# EAGLE design bracket (EAGLE 6.4)
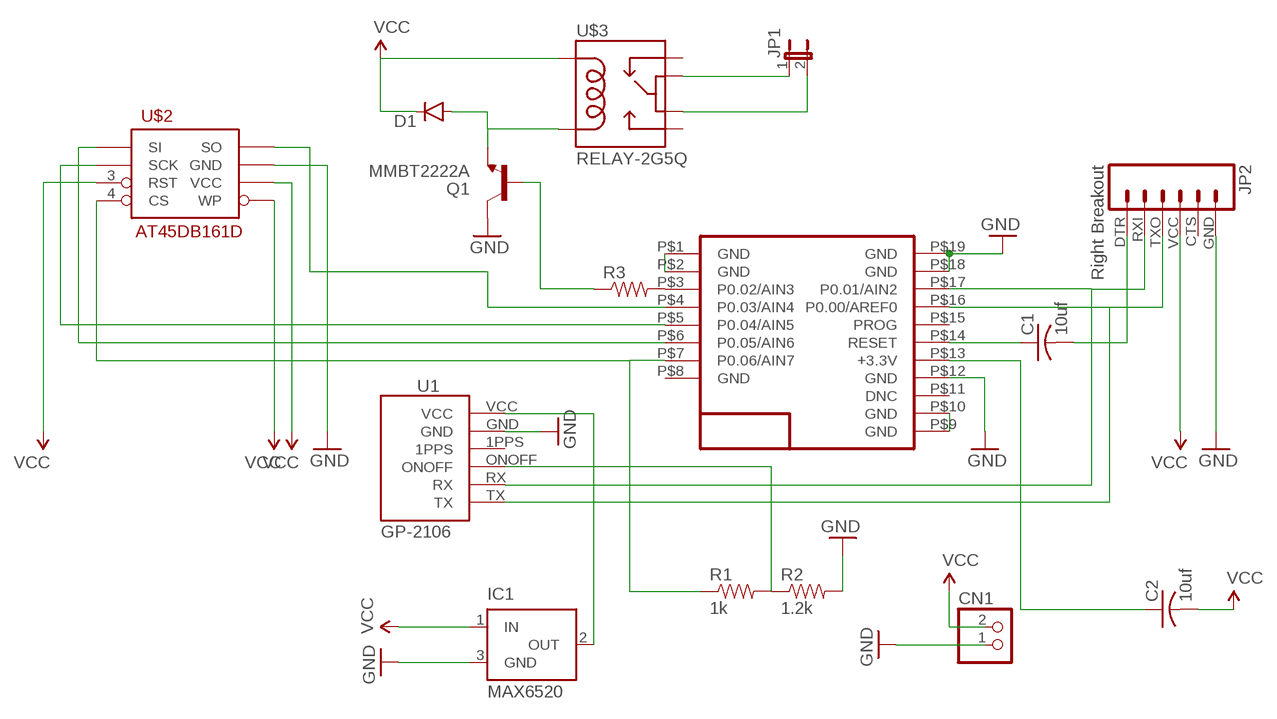
[diagram p0: schematic, sheet 1]

## Parts
C1  10uf  C-USC0603  [C0603]
C2  10uf  C-USC0603  [C0603]
CN1  JST_2PIN-SMT  [JST-PH-2-SMT]
D1  DIODESOD523  [SOD523]
IC1  MAX6520  [SOT23]
JP1  JP1E  [JP1]
JP2  Right Breakout  M06SIP  [1X06]
Q1  MMBT2222A  TRANSISTOR_NPNMMBT2222A  [SOT23-3]
R1  1k  RESISTOR0603-RES  [0603-RES]
R2  1.2k  RESISTOR0603-RES  [0603-RES]
R3  RESISTOR0603-RES  [0603-RES]
U1  GP-2106  [GP-2106]
U$1  RFD22301  [RFD21733]
U$2  AT45DB161D  [SO08-EIAJ]
U$3  RELAY-2G5Q  [RELAY-G5V]

## Nets
GND: CN1.1 IC1.3(GND) JP2.GND Q1.3(C) R2.2 U1.GND U$1.P$12(GND) U$1.P$18(GND) U$1.P$19(GND) U$2.7(GND)
N$1: JP2.RXI U1.RX U$1.P$17(P0.01/AIN2)
N$4: U$1.P$9(GND) U$1.P$10(GND)
N$5: U$1.P$1(GND) U$1.P$2(GND)
N$6: C1.1 U$1.P$14(RESET)
N$7: C1.2 JP2.DTR
N$8: JP2.TXO U1.TX U$1.P$16(P0.00/AREF0)
N$9: U$1.P$6(P0.05/AIN6) U$2.1(SI)
N$10: U$1.P$4(P0.03/AIN4) U$2.8(SO)
N$11: R3.2 U$1.P$3(P0.02/AIN3)
N$12: Q1.1(B) R3.1
N$13: D1.A Q1.2(E) U$3.9
N$14: U$1.P$5(P0.04/AIN5) U$2.2(SCK)
N$15: JP1.1 U$3.5
N$16: JP1.2 U$3.6
N$17: IC1.2(OUT) U1.VCC
N$18: R1.1 U$1.P$7(P0.06/AIN7) U$2.4(CS)
N$19: C2.1 U$1.P$13(+3.3V)
N$20: R1.2 R2.1 U1.ONOFF
VCC: C2.2 CN1.2 D1.C IC1.1(IN) JP2.VCC U$2.3(RST) U$2.5(WP) U$2.6(VCC) U$3.2
Unconnected: JP2.CTS U1.1PPS U$1.P$8(GND) U$1.P$11(DNC) U$1.P$15(PROG) U$3.1 U$3.10

## Library data of the parts
C1 C2 = adafruit:C-US: CAPACITOR, American symbol
CN1 = adafruit:JST_2PIN: JST 2-Pin Connectors of various flavors SMT-RA (S2B-PH-SM4) 4UConnector #17311 SMT (B2B-PH-SM4) THM-RA (S2B-PH) THM (B2B-PH)
D1 = SparkFun-DiscreteSemi:DIODE: Diode These are standard reverse protection diodes and small signal diodes. SMA package can handle up to about 1A. SOD-323 can handle about 200mA. What the SOD-323 package when ordering, there are some mfgs out there that are 5-pin packages.
IC1 = maxim:MAX6520: 1.2V Voltage Reference 50ppm/°C, SOT23, 3-Terminal Source: Data sheet <http://datasheets.maxim-ic.com/en/ds/MAX6520.pdf>; MF: MAXIM; MPN: MAX6520EUR-T; OC_FARNELL: unknown; OC_NEWARK: 02J4586
JP1 = jumper:JP1E: JUMPER
JP2 = SparkFun-Connectors:M06: Header 6 Standard 6-pin 0.1" header. Use with straight break away headers (SKU : PRT-00116), right angle break away headers (PRT-00553), swiss pins (PRT-00743), machine pins (PRT-00117), and female headers (PRT-00115). Molex polarized connector foot print use with SKU : PRT-08094 with associated crimp pins and housings. NOTES ON THE VARIANTS LOCK and LOCK_LONGPADS... This footprint was designed to help hold the alignment of a through-hole component (i.e. 6-pin header) while soldering it into place. You may notice that each hole has been shifted either up or down by 0.005 of an inch from it's more standard position (which is a perfectly straight line). This slight alteration caused the pins (the squares in the middle) to touch the edges of the holes. Because they are alternating, it causes a "brace" to hold the component in place. 0.005 has proven to be the perfect amount of "off-center" position when using our standard breakaway headers. Although looks a little odd when you look at the bare footprint, once you have a header in there, the alteration is very hard to notice. Also,if you push a header all the way into place, it is covered up entirely on the bottom side. This idea of altering the position of holes to aid alignment will be further integrated into the Sparkfun Library for other footprints. It can help hold any component with 3 or more connection pins.
Q1 = SparkFun-DiscreteSemi:TRANSISTOR_NPN: Generic NPN BJT MMBT2222A - TRANS-08049 (SOT-23, 1A 40V) MPSA42 - TRANS-09116 (SOT-23, 500mA 300V) MMBT5088LT1G - TRANS-11160 (SOT-23, 50 mA 30V) BC547 - COM-08928 <http://www.sparkfun.com/products/8928> (TO-92 45V 100mA) (1.Collector 2.Base 3.Emitter) 2N3904 - COM-00521 <http://www.sparkfun.com/products/521> (TO-92 40V 200mA) (1.Emitter 2.Base 3.Collector) P2N2222A - COM-12852 <http://www.sparkfun.com/products/12852> (TO-92 40V 600mA) (1.Collector 2.Base 3.Emitter); PROD_ID: TRANS-08049
R1-R3 = SparkFun-Passives:RESISTOR: Resistor Basic schematic elements and footprints for 0603, 1206, and PTH resistors.
U1 = SparkFun-RF:GP-2106: GP-2106 GPS SiRF IV
U$1 = RFD22301-11.25.13:RFD22301: RF Digital RFD22301
U$2 = SparkFun-DigitalIC:AT45DB161D: 16-Mbit SPI flash memory
U$3 = SparkFun-Electromechanical:RELAY-2: SPDT relay (COM-00100)

## Board
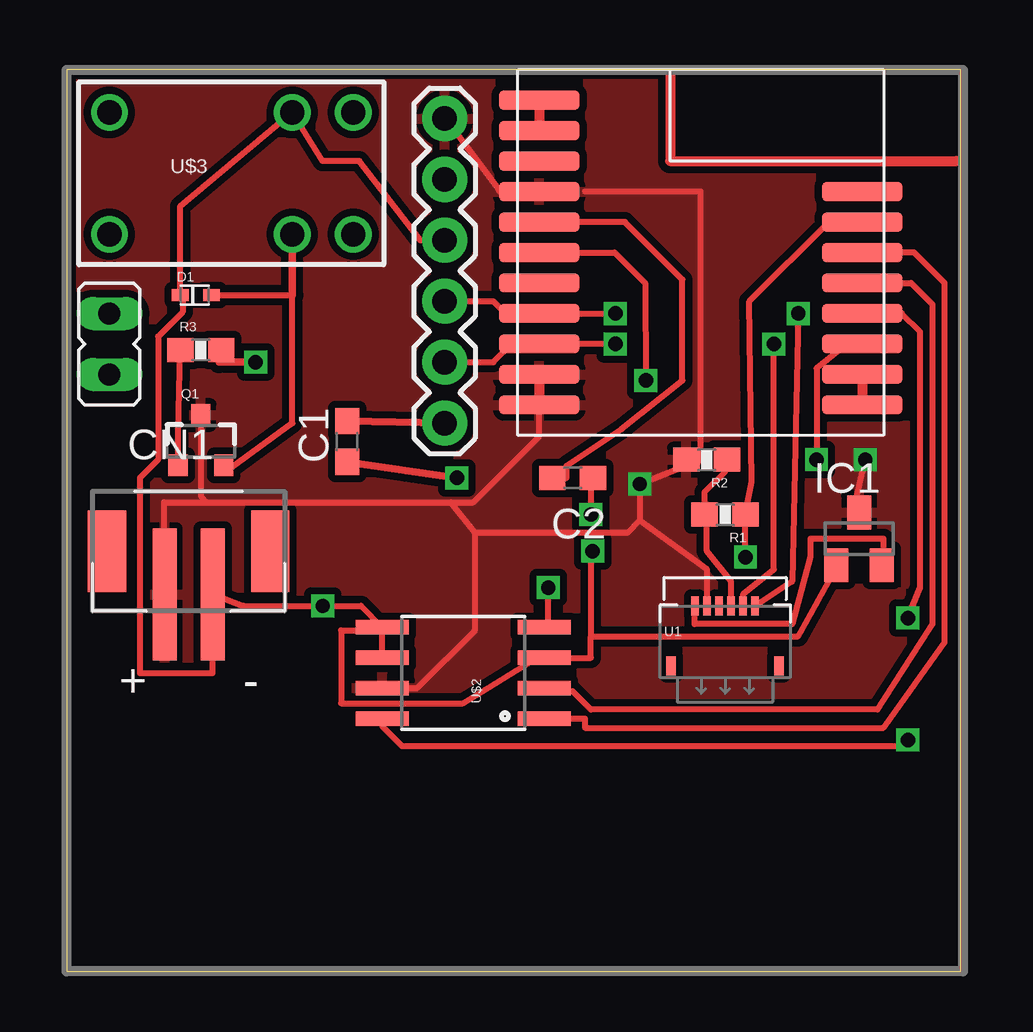
[diagram p1: board, top side]
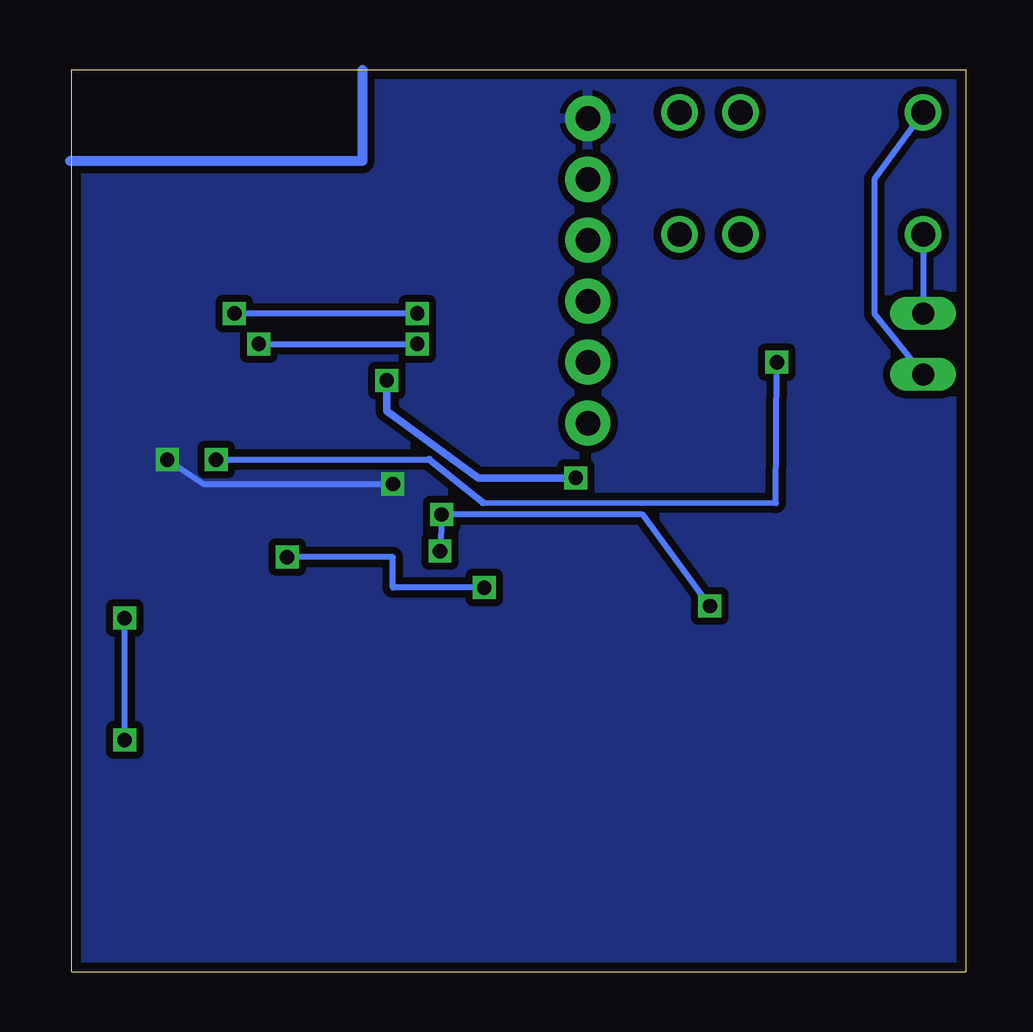
[diagram p2: board, bottom side, seen from below]

Size 37.26 x 37.59 mm. Coordinates in mm from the lower left corner, seen from the top.
Outline: 37.26,0 37.26,37.59 0,37.59 0,0 37.26,0
Copper layers (1*16): Top 0.0356mm / dielectric 1.5011mm / Bottom 0.0356mm
Design rules "LaenPCBOrder": minimum track width 6mil, minimum drill 13mil, track to track 6mil, track to pad 6mil, pad to pad 6mil, via to via 6mil, smd to smd 6mil, copper to edge 15mil, drill to drill 6mil, minimum pad ring 7mil, minimum via ring 7mil, stop-mask expansion 3mil, vias tented up to drill 0mil, thermal gap 10mil

### Footprints (pad centres in the part's own frame; a part is rotated, then mirrored left to right if it is on the bottom)
C0603 = smd 1.1 x 1: 1 -0.85,0; 2 0.85,0
JST-PH-2-SMT = smd 1 x 5.5: 1 -1,-1.8; 2 1,-1.8 | smd 1.6 x 3.4: NC1 -3.4,0; NC2 3.4,0
SOD523 = smd 0.7 x 0.5: A 0.7,0; C -0.6,0
SOT23 = smd 1 x 1.4: 1 -0.95,-1.1; 2 0.95,-1.1; 3 0,1.1
JP1 = drill 0.914 long: 1 0,-1.27; 2 0,1.27
1X06 = drill 1.016 pad 1.88: CTS 10.16,0; DTR 0,0; GND 12.7,0; RXI 2.54,0; TXO 5.08,0; VCC 7.62,0
SOT23-3 = smd 0.8 x 0.9: 1 -0.95,-1; 2 0.95,-1; 3 0,1.1
0603-RES = smd 1.1 x 1: 1 -0.85,0; 2 0.85,0
GP-2106 = smd 0.3 x 0.8: 1PPS -0.25,0; GND -0.75,0; ONOFF 0.25,0; RX 0.75,0; TX 1.25,0; VCC -1.25,0 | smd 0.4 x 0.8: P$7 -2.25,-2.5; P$8 2.25,-2.5
RFD21733 = smd 3.353 x 0.813: P$1 -6.731,6.35; P$2 -6.731,5.08; P$3 -6.731,3.81; P$4 -6.731,2.54; P$5 -6.731,1.27; P$6 -6.731,0; P$7 -6.731,-1.27; P$8 -6.731,-2.54; P$9 6.731,-6.35; P$10 6.731,-5.08; P$11 6.731,-3.81; P$12 6.731,-2.54; P$13 6.731,-1.27; P$14 6.731,0; P$15 6.731,1.27; P$16 6.731,2.54; P$17 6.731,3.81; P$18 6.731,5.08; P$19 6.731,6.35
SO08-EIAJ = smd 0.61 x 2.21: 1 -1.905,-3.378; 2 -0.635,-3.378; 3 0.635,-3.378; 4 1.905,-3.378; 5 1.905,3.353; 6 0.635,3.353; 7 -0.635,3.353; 8 -1.905,3.353
RELAY-G5V = drill 1.016: 1 5.08,2.54; 2 2.54,2.54; 5 -5.08,2.54; 6 -5.08,-2.54; 9 2.54,-2.54; 10 5.08,-2.54

### Placement (x,y rotation side)
C1  11.68,22.11 90 top
C2  21.08,20.58 0 top
CN1  5.08,17.54 0 top
D1  5.33,28.2 0 top
IC1  33.02,18.04 0 top
JP1  1.78,26.17 0 top
JP2  15.75,22.87 90 top
Q1  5.59,22.11 0 top
R1  27.43,19.06 180 top
R2  26.67,21.35 180 top
R3  5.59,25.92 0 top
U1  27.43,15.25 0 top
U$1  26.42,29.98 180 top
U$2  16.51,12.46 90 top
U$3  6.86,33.28 0 top

### Tracks (layer width: path | path; a pad name or v marks a point on that pad's centre or on a via)
GND  (via drill 0.6)
  Top 0.254: 18.03,32.56 15.75,35.61 | CN1.1 4.06,15.74 4.06,19.57 5.84,19.57 | 5.84,19.57 16,19.57 | 16,19.57 16.94,19.57 19.69,22.31 U$1.P$19 | IC1.3 32.77,19.14 v33.27,21.35 | v23.88,20.33 26.42,21.35 | 26.42,21.35 26.42,32.52 21.59,32.52 | R2.2 26.42,21.35 | U1.GND 26.68,16.76 23.88,18.81 | 23.88,20.08 v23.88,20.33 | v23.88,20.33 23.88,18.81 | 23.88,18.81 23.37,18.3 17.02,18.3 | 17.02,18.3 16,19.57 | U$2.7 14.61,11.82 17.02,14.23 17.02,18.3 | Q1.3 5.59,19.82 5.84,19.57
  Top 0.305: U$1.P$12 20.11,32.52 18.03,32.56 | 15.75,35.61 15.54,35.57 JP2.GND
  Top 0.406: U$1.P$18 U$1.P$19
  Bottom 0.254: v33.27,21.35 31.75,20.33 v23.88,20.33
  pour Top (isolate 0.305): 0,37.6 37.34,37.6 37.34,0.01 0,0.01
  pour Bottom (isolate 0.305): 0,37.6 37.34,37.6 37.34,0.01 0,0.01
N$1  (via drill 0.6)
  Top 0.254: JP2.RXI 17.78,25.41 18.54,26.17 U$1.P$17 v22.86,26.17 | U1.RX 28.19,15.25 28.19,15.76 29.46,16.77 v29.46,26.17
  Bottom 0.254: v29.46,26.17 v22.86,26.17
N$2
  Top 0.406: 25.15,37.6 25.15,33.79 37.08,33.79
N$3
  Bottom 0.406: 25.15,37.6 25.15,33.79 37.34,33.79
N$4
  Top 0.406: U$1.P$9 U$1.P$10
N$5
  Top 0.406: 33.78,24.9 U$1.P$2 U$1.P$1
N$6  (via drill 0.6)
  Top 0.254: U$1.P$14 22.83,29.98 24.1,28.71 v24.13,24.65
  Top 0.305: C1.1 v16.26,20.58
  Bottom 0.305: v16.26,20.58 20.32,20.58 24.13,23.38 v24.13,24.65
N$7
  Top 0.305: C1.2 JP2.DTR
N$8  (via drill 0.6)
  Top 0.254: JP2.TXO 17.78,27.95 18.29,27.44 U$1.P$16 v22.86,27.44 | v30.48,27.44 30.23,16.27 U1.TX
  Bottom 0.254: v22.86,27.44 v30.48,27.44
N$9
  Top 0.254: U$2.1 21.59,10.55 21.59,10.17 34.04,10.17 36.58,13.73 36.58,28.71 35.31,29.98 U$1.P$6
N$10  (via drill 0.6)
  Top 0.254: U$2.8 13.16,10.22 13.97,9.41 34.54,9.41 v35.05,9.66 | v35.05,14.74 35.56,16.01 35.56,26.68 34.8,27.44 U$1.P$4
  Bottom 0.254: v35.05,9.66 v35.05,14.74
N$11  (via drill 0.6)
  Top 0.254: 32.51,26.17 31.24,25.16 v31.24,21.35
  Top 0.305: 34.04,26.17 U$1.P$3 32.51,26.17 | v7.87,25.41 6.35,25.41 R3.2
  Bottom 0.254: v31.24,21.35 22.35,21.35 | 20.12,19.57 7.92,19.53 v7.87,25.41
  Bottom 0.305: 22.35,21.35 20.12,19.57
N$12
  Top 0.254: Q1.1 4.64,22.52 R3.1
N$13
  Top 0.152: 6.6,20.84 Q1.2
  Top 0.254: 6.6,20.84 9.4,22.87 9.4,28.2 D1.A
  Top 0.305: 9.4,28.2 U$3.9
N$14
  Top 0.254: U$1.P$5 35.19,28.71 36.07,27.83 36.07,14.49 33.78,10.93 21.84,10.93 21.08,11.69 19.89,11.69 U$2.2
N$15
  Bottom 0.254: JP1.1 3.81,27.44 3.81,33.03 U$3.5
N$16
  Bottom 0.254: U$3.6 JP1.2
N$17
  Top 0.254: IC1.2 34.04,16.94 34.04,18.04 30.99,18.04 30.99,17.28 30.23,14.49 26.16,14.49 26.16,15.25 U1.VCC
N$18  (via drill 0.6)
  Top 0.254: U$1.P$7 31.75,31.25 28.45,27.95 28.54,20.42 R1.1 v28.28,17.28 | U$2.4 20.07,14.36 v20.07,16.01
  Bottom 0.254: v20.07,16.01 23.88,16.01 23.88,17.28 v28.28,17.28
N$19
  Top 0.254: C2.1 20.83,20.58 20.83,21.09 23.11,22.62 25.65,24.65 25.65,28.86 23.26,31.25 U$1.P$13
N$20
  Top 0.254: R1.2 26.33,19.23 | 27.94,21.09 27.69,21 R2.1 27.43,21.26 27.43,20.84 26.58,19.99 R1.2 | U1.ONOFF 27.69,16.27 26.67,17.54 26.67,19.48 R1.2
N$27
  Top 0.254: 20.07,13.22 19.81,13.22 16.51,11.19 11.43,11.19 11.43,14.23 12.95,14.23 13.21,14.49
VCC  (via drill 0.6)
  Top 0.254: JP2.VCC 14.73,30.49 12.19,33.79 10.67,33.79 U$3.2 4.73,31.92 D1.C 4.83,28.2 4.83,27.5 3.81,26.49 3.81,21.35 3.05,20.58 3.05,12.46 6.08,12.46 CN1.2 6.12,15.74 7.37,15.25 v10.67,15.25 12.27,15.25 U$2.5 U$2.6 | C2.2 21.84,20.58 v21.84,19.06 | v21.91,17.54 21.84,17.54 21.84,13.98 | 21.84,13.98 30.48,13.98 32.07,16.84 IC1.1 | U$2.3 21.84,13.09 21.84,13.98
  Bottom 0.254: v21.91,17.54 v21.84,19.06 13.46,19.06 v10.67,15.25